# Altium schematic sheet BUTTONS.schdoc
size 192 x 152 mm
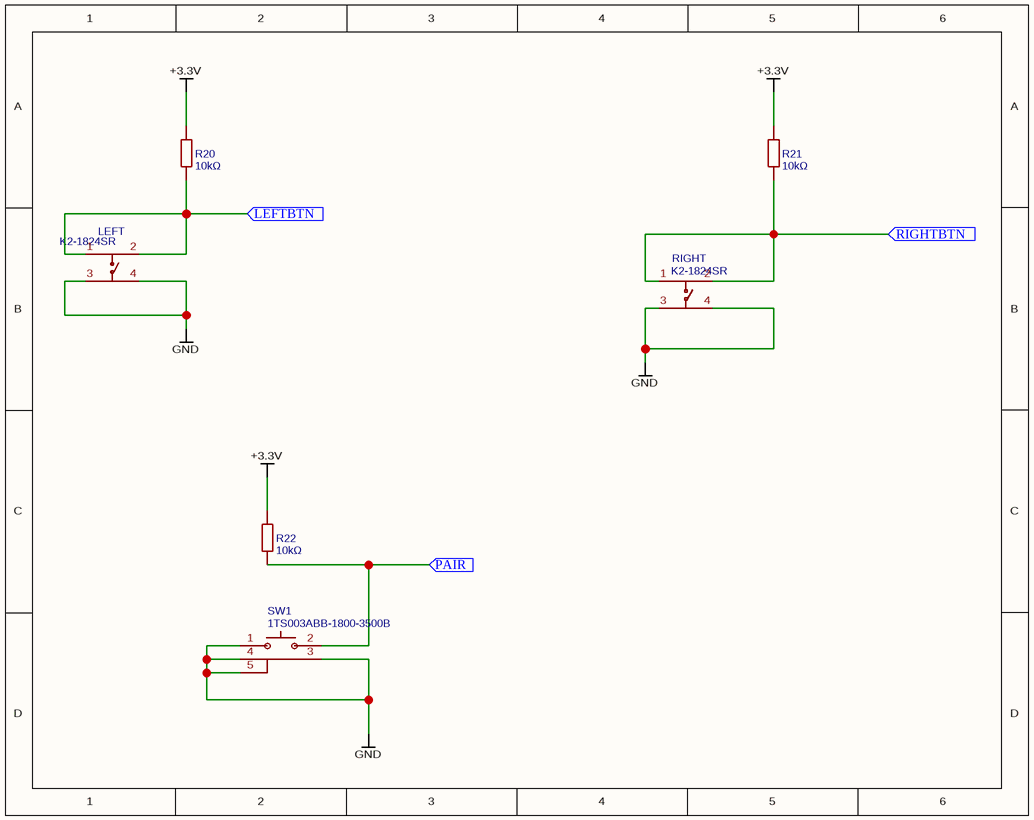
[diagram p0: BUTTONS.schdoc]

## Parts
LEFT  K2-1824SR  [SW-SMD_4P-L4.5-W4.5-P3.50-LS5.0]
R20  10kΩ  [R0603]
R21  10kΩ  [R0603]
R22  10kΩ  [R0603]
RIGHT  K2-1824SR  [SW-SMD_4P-L4.5-W4.5-P3.50-LS5.0]
SW1  1TS003ABB-1800-3500B  [KEY-SMD_1TS003A]

## Ports
LEFTBTN (in), PAIR (in), RIGHTBTN (in)

## Nets
+3.3V: R20.2 R21.2 R22.2
GND: LEFT.3 LEFT.4 RIGHT.3 RIGHT.4 SW1.1(A) SW1.3 SW1.4 SW1.5
LEFTBTN: LEFT.1 LEFT.2 R20.1 ; port LEFTBTN
PAIR: R22.1 SW1.2(B) ; port PAIR
RIGHTBTN: R21.1 RIGHT.1 RIGHT.2 ; port RIGHTBTN

## Library data of the parts
LEFT RIGHT = K2-1824SR: BOM_Manufacturer: HRO; BOM_Manufacturer Part: K2-1824SR-B4SW-06; Contributor: LCSC; BOM_Supplier: LCSC; BOM_Supplier Part: C128938; BOM_JLCPCB Part Class: Extended Part; spicePre: S; spiceSymbolName: K2-1824SR-B4SW-06
R20-R22 = 10kΩ: BOM_Manufacturer: Guangdong Fenghua Advanced Tech; BOM_Manufacturer Part: RS-03K1002FT; Resistance (Ohms): 10K; nameAlias: Resistance; Contributor: LCSC; BOM_Supplier: LCSC; BOM_Supplier Part: C115324; BOM_JLCPCB Part Class: Extended Part; spicePre: R; spiceSymbolName: RS-03K1002FT
SW1 = 1TS003ABB-1800-3500B: BOM_Manufacturer: HYP; Contributor: LCSC; BOM_Supplier: LCSC; BOM_Supplier Part: C319390; BOM_Manufacturer Part: 1TS003ABB-1800-3500B; BOM_JLCPCB Part Class: Extended Part; spicePre: S; spiceSymbolName: 1TS003ABB-1800-3500B